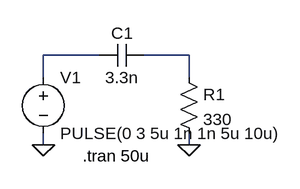
[diagram p0: schematic Draft2.asc]
Draft2.asc, the LTspice schematic file:
Version 4
SHEET 1 880 680
WIRE 64 160 -16 160
WIRE 192 160 128 160
WIRE -16 192 -16 160
WIRE 192 192 192 160
WIRE -16 288 -16 272
WIRE 192 288 192 272
FLAG -16 288 0
FLAG 192 288 0
SYMBOL voltage -16 176 R0
WINDOW 123 0 0 Left 0
WINDOW 39 0 0 Left 0
SYMATTR InstName V1
SYMATTR Value PULSE(0 3 5u 1n 1n 5u 10u)
SYMBOL cap 128 144 R90
WINDOW 0 0 32 VBottom 2
WINDOW 3 32 32 VTop 2
SYMATTR InstName C1
SYMATTR Value 3.3n
SYMBOL res 176 176 R0
SYMATTR InstName R1
SYMATTR Value 330
TEXT 40 304 Left 2 !.tran 50u

The netlist it stands for:
* Draft2.asc
V1 N001 0 PULSE(0 3 5u 1n 1n 5u 10u)
C1 N002 N001 3.3n
R1 N002 0 330
.tran 50u
.backanno
.end